# Altium schematic sheet 21. SOC USB2.0.SchDoc: SOC - USB 2.0
size 513 x 386 mm; Project: PROC154E2(001)_SK_AM69; Issue: 1.0; RevCode: E3; Page Create Date: March  8, 1995; Variant Name: Core Design; Schematic Page Number: 21; Page Number: 21; Page Size: C; Comment: MISTRAL_TITLEBLK_CSIZE_1; Page Count: 62; Schematic Page Count: 62; Name: PROC154E2 001 SK AM69; DsnPath: C:\Users\danie\Downloads\sprr466c\PROC154E3_RP\PROC154E3_SCH.DSN; SchematicName: SCHEMATIC1; PageName: 21. SOC USB2.0; PageSize: C; TopSchematic: True
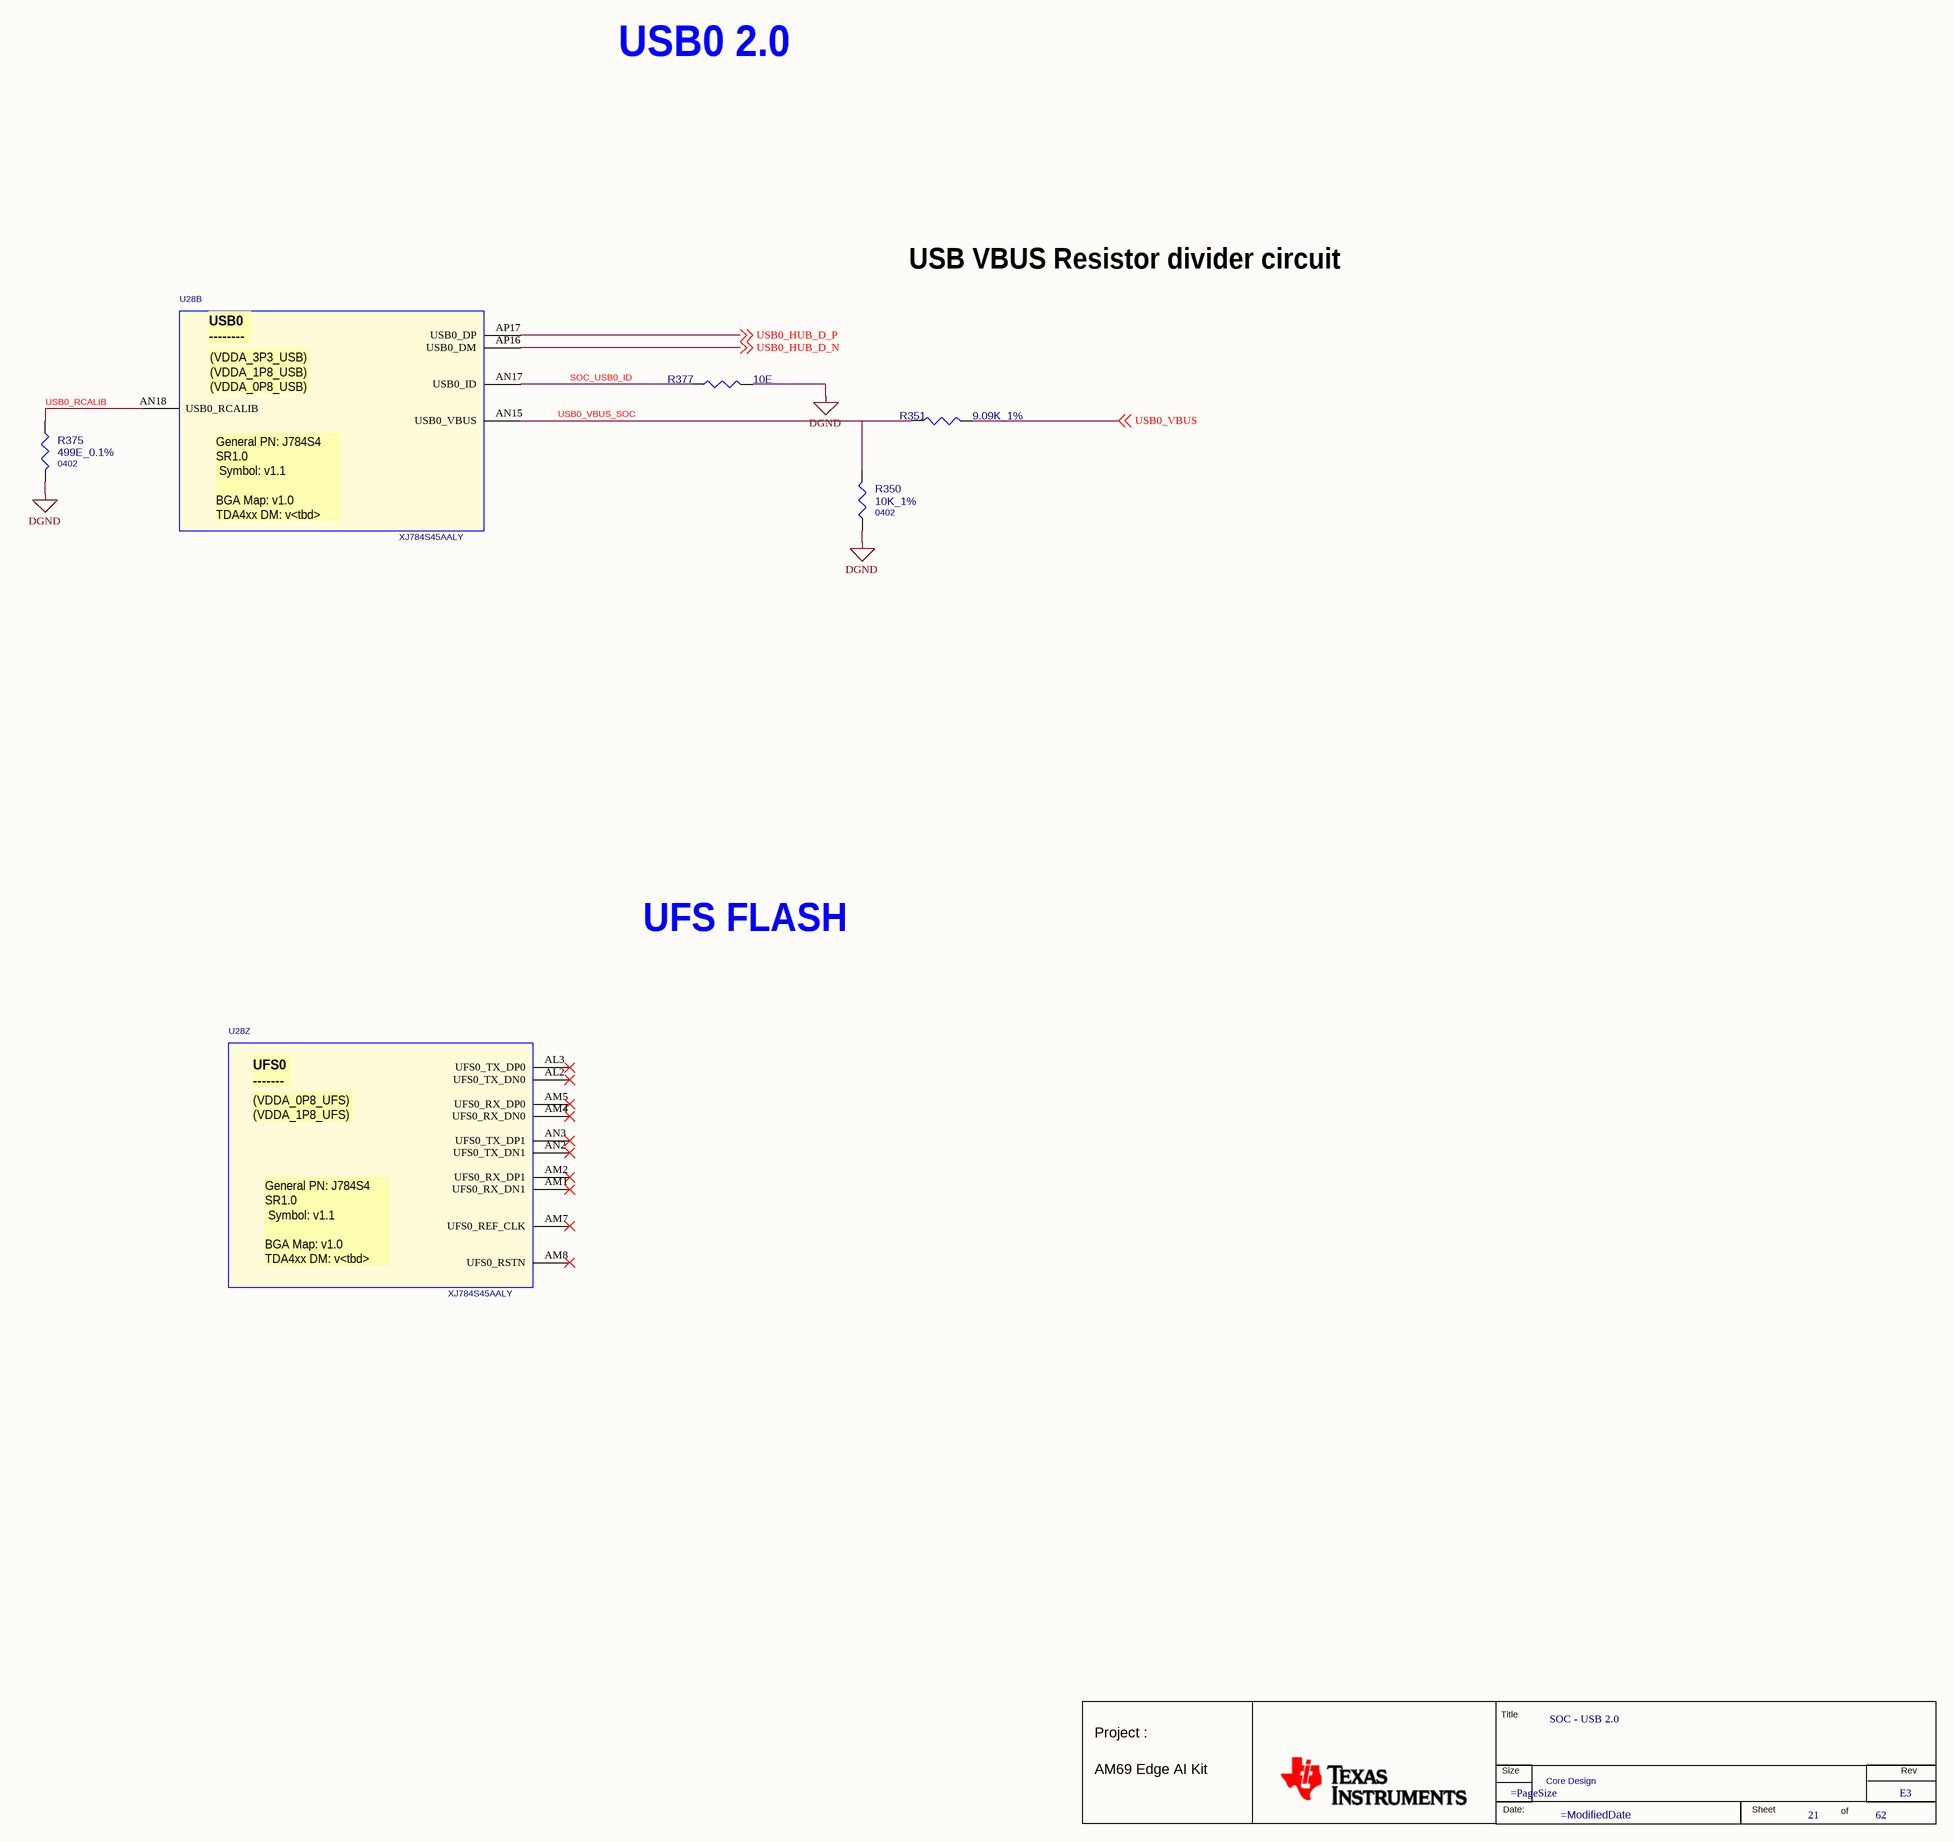
[diagram p0: 21. SOC USB2.0.SchDoc]

## Parts
*  RevCode: E3  Title: SOC - USB 2.0  Page Number: 21  Page Count: 62  Variant Name: Core Design  (hidden comment: MISTRAL_TITLEBLK_CSIZE_1)  (graphical)
R350  10K_1%  Package: 0402  [RES0402_0-5]
R351  9.09K_1%  [RES0402_0-5]
R375  499E_0.1%  Package: 0402  [RES0402_0-5]
R377  10E  [RES0402_0-5]
U28  XJ784S45AALY  [BGA1414_31-49_1230X1230_2-7]  (parts B,Z of 26)

## Nets
DGND: R350.1 R375.2 R377.2
SOC_USB0_ID: R377.1 U28.AN17(USB0_ID)
USB0_HUB_D_N: U28.AP16(USB0_DM) ; off-sheet USB0_HUB_D_N
USB0_HUB_D_P: U28.AP17(USB0_DP) ; off-sheet USB0_HUB_D_P
USB0_RCALIB: R375.1 U28.AN18(USB0_RCALIB)
USB0_VBUS: R351.2 ; off-sheet USB0_VBUS
USB0_VBUS_SOC: R350.2 R351.1 U28.AN15(USB0_VBUS)

Not connected (* = marked no-connect by the designer): U28 AL2(UFS0_TX_DN0)* AL3(UFS0_TX_DP0)* AM1(UFS0_RX_DN1)* AM2(UFS0_RX_DP1)* AM4(UFS0_RX_DN0)* AM5(UFS0_RX_DP0)* AM7(UFS0_REF_CLK)* AM8(UFS0_RSTN)* AN2(UFS0_TX_DN1)* AN3(UFS0_TX_DP1)*

## Notes on the sheet
- USB0 2.0
- USB VBUS Resistor divider circuit
- UFS FLASH
- (in symbol J7AHPSoC-EVM_BGA1414, part B) USB0 / --------; (VDDA_3P3_USB) / (VDDA_1P8_USB) / (VDDA_0P8_USB); General PN: J784S4 / SR1.0 / Symbol: v1.1 / BGA Map: v1.0 / TDA4xx DM: v<tbd>
- (in symbol J7AHPSoC-EVM_BGA1414, part Z) UFS0 / -------; (VDDA_0P8_UFS) / (VDDA_1P8_UFS); General PN: J784S4 / SR1.0 / Symbol: v1.1 / BGA Map: v1.0 / TDA4xx DM: v<tbd>
- (in symbol MISTRAL_TITLEBLK_CSIZE_1) Title; Project :; Size; Rev; AM69 Edge AI Kit; Date:; Sheet; of

## Library data of the parts
* = MISTRAL_TITLEBLK_CSIZE_1: Issue: 1.0; Project: PROC154E2(001)_SK_AM69; Name: PROC154E2 001 SK AM69; Page Create Date: March  8, 1995; Page Size: =PageSize; Page Modify Date: =ModifiedDate; Schematic Page Count: 62; Schematic Page Number: 21
R350 = RESISTOR_Dup2: RES 10K 1/16W 1% 0402; Part Reference: R350; Part_type: RESISTORS\FIXED; Mfr_part_number: RC0402FR-0710KL; Mfr_name: YAGEO AMERICA; Mistral Part No: 110015090015-R; Custom_Duty: 15%; Customs_HS_Code: 85332119; Voltage: NA; Project: VOCERA; Value: 10K_1%; PCB Footprint: RES0402_0-5; Footprint Path: Y:\MIS_DATABASE\Library\ALTIUM_TOOL\PCB_FOOTPRINTS\Altium_Footprint_Lib.PcbLib; Library Path: Y:\MIS_DATABASE\Library\ALTIUM_TOOL\SCHEMATICS_PARTS\MS_DISCRETE_Library.schlib; MECHANICAL 3D STEP FILE: RES0402_0-5; Chkd/date: VASANTHA/201216; Crtd /date: GEETHA/290506; Datasheet: Y:\MIS_DATABASE\DATASHEETS\RESISTORS\RCXXXXL-SER_MAR18.PDF; Temperature: -55°C+155°C; Weight: 0.65mg; Height: 0.40MM; Library Ref: RESISTOR; Distributor_part_number: 311-10.0KLRTR-ND; Distributor_name: DIGIKEY; Wattage: 1/16W; Tolerance: 1%; Footprint Ref: RES0402_0-5
R351 = RESISTOR_Dup2: RES 9.09K 1/16W 1% 0402; Part Reference: R351; Mistral Part No: 110011060006-R; Mfr_name: VISHAY; Mfr_part_number: CRCW04029K09FKED; Part_type: RESISTORS\FIXED; Project: TE_MODULE; Voltage: NA; Customs_HS_Code: 85332119; Custom_Duty: 15%; Value: 9.09K_1%; Footprint Ref: RES0402_0-5; Tolerance: 1%; Wattage: 1/16W; Package: 0402; Distributor_name: DIGIKEY; Distributor_part_number: 541-9.09KLCT-ND; Library Ref: RESISTOR; Height: 0.40MM; Weight: 0.65mg; Temperature: -55°C+155°C; Datasheet: Y:\MIS_DATABASE\DATASHEETS\RESISTORS\CRCW0603.PDF; Crtd /date: BAVISH/010611; Chkd/date: VASANTHA/281216; MECHANICAL 3D STEP FILE: RES0402_0-5; Library Path: Y:\MIS_DATABASE\Library\ALTIUM_TOOL\SCHEMATICS_PARTS\MS_DISCRETE_Library.schlib; Footprint Path: Y:\MIS_DATABASE\Library\ALTIUM_TOOL\PCB_FOOTPRINTS\Altium_Footprint_Lib.PcbLib; PCB Footprint: RES0402_0-5
R375 = RESISTOR_Dup2: RES 499E 1/16W 0.1% 0402; Part Reference: R375; Mistral Part No: 110021020006-R; Manufacturer: YAGEO AMERICA; Mfr_part_number: RT0402BRD07499RL; Part_type: RESISTORS\FIXED; Project: TI_AM62x SKEVM_BRD; Voltage: NA; Customs_HS_Code: 85332119; Custom_Duty: 15%; Value: 499E_0.1%; PCB Footprint: RES0402_0-5; Footprint Ref: RES0402_0-5; Tolerance: 0.1%; Wattage: 1/16W; Distributor_name: DIGIKEY; Distributor_part_number: YAG1440CT-ND; Library Ref: RESISTOR; Height: 0.35MM; Weight: 0.65mg; Temperature: -55°C+155°C; Datasheet: Y:\MIS_DATABASE\DATASHEETS\RESISTORS\YAGEO_RT-SERIES.PDF; Crtd /date: MANIRAJA/200921; Chkd/date: ALVY/200921; MECHANICAL 3D STEP FILE: RES0402_0-5; Library Path: Y:\MIS_DATABASE\Library\ALTIUM_TOOL\SCHEMATICS_PARTS\MS_DISCRETE_Library.schlib; Footprint Path: Y:\MIS_DATABASE\Library\ALTIUM_TOOL\PCB_FOOTPRINTS\Altium_Footprint_Lib.PcbLib; Mfr_name: YAGEO AMERICA
R377 = RESISTOR_Dup2: RES 10E 1/16W 5% 0402; Part Reference: R377; Mistral Part No: 110015080004-R; Mfr_name: YAGEO AMERICA; Mfr_part_number: RC0402JR-0710RL; Part_type: RESISTORS\FIXED; Project: PDLU; Voltage: NA; Customs_HS_Code: 85332119; Custom_Duty: 15%; Value: 10E; Footprint Ref: RES0402_0-5; Tolerance: 5%; Wattage: 1/16W; Package: 0402; Distributor_name: DIGIKEY; Distributor_part_number: 311-10JRCT-ND; Library Ref: RESISTOR; Height: 0.40MM; Weight: 0.65mg; Temperature: -55°C+155°C; Datasheet: Y:\MIS_DATABASE\DATASHEETS\RESISTORS\RCXXXXL-SER_MAR18.PDF; Crtd /date: JEBRAN/050815; Chkd/date: JEBRAN/050815; MECHANICAL 3D STEP FILE: RES0402_0-5; Library Path: Y:\MIS_DATABASE\Library\ALTIUM_TOOL\SCHEMATICS_PARTS\MS_DISCRETE_Library.schlib; Footprint Path: Y:\MIS_DATABASE\Library\ALTIUM_TOOL\PCB_FOOTPRINTS\Altium_Footprint_Lib.PcbLib; PCB Footprint: RES0402_0-5
U28 = J7AHPSoC-EVM_BGA1414: IC AM69 SoC EVM MICROPROCESSOR BGA1414; Part Reference: U28; Manufacturer: TEXAS INSTRUMENTS; Part_type: ICS\DIGITAL\MICROPROCESSOR; Mistral Part No: 141230020002; SPLIT_INST: TRUE; SWAP_INFO: (S1+S2+S3+S4+S5+S6+S7+S8+S9+S10+S11+S12+S13+S14+S15+S16+S17+S18+S19+S20+S21+S22+S23+S24+S25+S26); Custom_Duty: 15%; Customs_HS_Code: 85423100; Wattage: NA; Project: TI_J7AHP SK_BRD; Value: XJ784S45AALY; Footprint Path: Y:\MIS_DATABASE\Library\ALTIUM_TOOL\PCB_FOOTPRINTS\Altium_Footprint_Lib.PcbLib; Library Path: Y:\MIS_DATABASE\Library\ALTIUM_TOOL\SCHEMATICS_PARTS\MS_MICROPROCESSOR_Library.schlib; MECHANICAL 3D STEP FILE: BGA1414_31-49_1230X1230_2-7; RoHS: NA; Chkd/date: MANIRAJA/151221; Crtd /date: ALVY/141221; Datasheet: Y:\MIS_DATABASE\DATASHEETS\ICS\DIGITAL\MICROCONTROLLER\J7AHP-SoC-EVM.PDF; Temperature: NA; Weight: NA; Height: 2.70MM; Library Ref: J7AHPSoC-EVM_BGA1414; Distributor_part_number: NA; Distributor_name: NA; Package: BGA1414; Voltage: NA; Tolerance: NA; Mfr_part_number: XJ784S45AALY; Mfr_name: TEXAS INSTRUMENTS; Footprint Ref: BGA1414_31-49_1230X1230_2-7; PCB Footprint: BGA1414_31-49_1230X1230_2-7